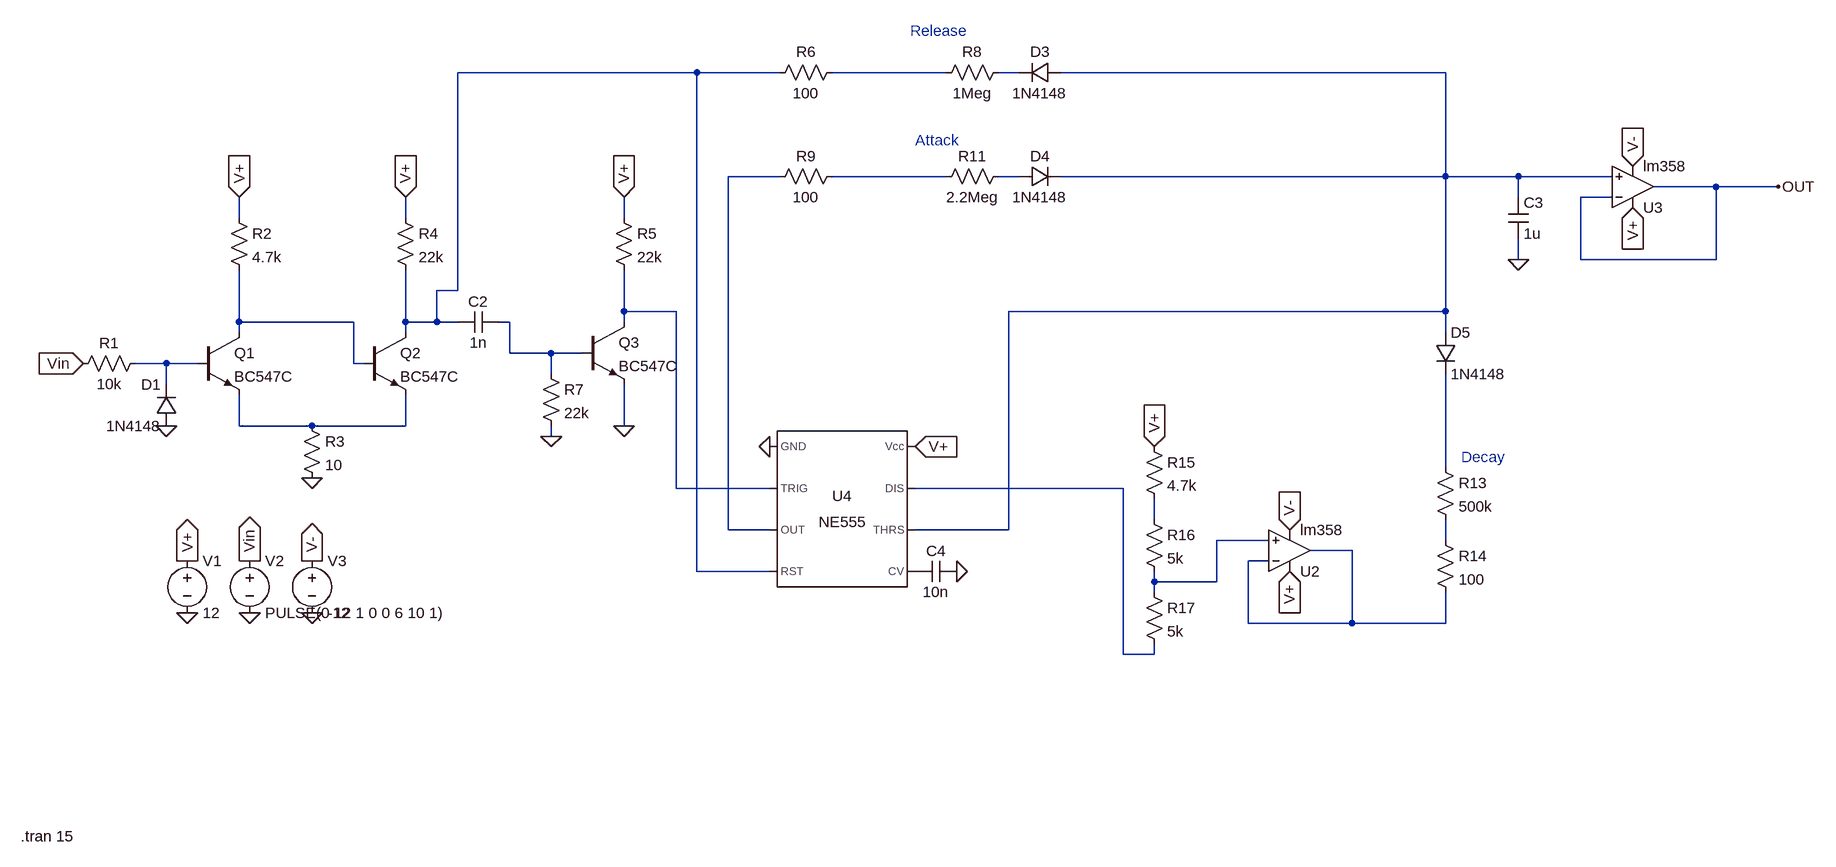
[diagram p0: schematic Copia de EG con NE555 aprendiendo.asc]
Copia de EG con NE555 aprendiendo.asc, the LTspice schematic file:
Version 4
SHEET 1 1860 680
WIRE 128 -560 -240 -560
WIRE 256 -560 128 -560
WIRE 512 -560 336 -560
WIRE 624 -560 592 -560
WIRE 1280 -560 688 -560
WIRE 256 -400 176 -400
WIRE 512 -400 336 -400
WIRE 624 -400 592 -400
WIRE 1280 -400 1280 -560
WIRE 1280 -400 688 -400
WIRE 1392 -400 1280 -400
WIRE 1536 -400 1392 -400
WIRE 1696 -384 1600 -384
WIRE 1792 -384 1696 -384
WIRE 1392 -368 1392 -400
WIRE 1536 -368 1488 -368
WIRE -576 -336 -576 -368
WIRE -320 -336 -320 -368
WIRE 16 -336 16 -368
WIRE 1392 -272 1392 -304
WIRE 1488 -272 1488 -368
WIRE 1696 -272 1696 -384
WIRE 1696 -272 1488 -272
WIRE -240 -224 -240 -560
WIRE -240 -224 -272 -224
WIRE 16 -192 16 -256
WIRE 96 -192 16 -192
WIRE 1280 -192 1280 -400
WIRE 1280 -192 608 -192
WIRE -576 -176 -576 -256
WIRE -400 -176 -576 -176
WIRE -320 -176 -320 -256
WIRE -272 -176 -272 -224
WIRE -272 -176 -320 -176
WIRE -240 -176 -272 -176
WIRE -160 -176 -176 -176
WIRE 16 -176 16 -192
WIRE -576 -160 -576 -176
WIRE -320 -160 -320 -176
WIRE 1280 -160 1280 -192
WIRE -160 -128 -160 -176
WIRE -96 -128 -160 -128
WIRE -48 -128 -96 -128
WIRE -688 -112 -736 -112
WIRE -640 -112 -688 -112
WIRE -400 -112 -400 -176
WIRE -384 -112 -400 -112
WIRE -96 -96 -96 -128
WIRE -688 -80 -688 -112
WIRE -576 -16 -576 -64
WIRE -464 -16 -576 -16
WIRE -320 -16 -320 -64
WIRE -320 -16 -464 -16
WIRE 16 -16 16 -80
WIRE -96 0 -96 -16
WIRE 1280 48 1280 -96
WIRE 96 80 96 -192
WIRE 240 80 96 80
WIRE 784 80 464 80
WIRE 832 128 832 96
WIRE 176 144 176 -400
WIRE 240 144 176 144
WIRE 608 144 608 -192
WIRE 608 144 464 144
WIRE 1008 160 928 160
WIRE 1280 160 1280 128
WIRE 1136 176 1072 176
WIRE 1008 192 976 192
WIRE 128 208 128 -560
WIRE 240 208 128 208
WIRE 832 224 832 208
WIRE 928 224 928 160
WIRE 928 224 832 224
WIRE 832 240 832 224
WIRE 976 288 976 192
WIRE 1136 288 1136 176
WIRE 1136 288 976 288
WIRE 1280 288 1280 240
WIRE 1280 288 1136 288
WIRE 784 336 784 80
WIRE 832 336 832 320
WIRE 832 336 784 336
FLAG -464 272 0
FLAG -560 272 0
FLAG -656 272 0
FLAG -656 192 V+
IOPIN -656 192 Out
FLAG -560 192 Vin
IOPIN -560 192 Out
FLAG -816 -112 Vin
IOPIN -816 -112 In
FLAG -688 -16 0
FLAG -576 -368 V+
IOPIN -576 -368 In
FLAG -320 -368 V+
IOPIN -320 -368 In
FLAG -96 0 0
FLAG 16 -368 V+
IOPIN 16 -368 In
FLAG 16 -16 0
FLAG 832 16 V+
IOPIN 832 16 In
FLAG -464 192 V-
IOPIN -464 192 Out
FLAG 1040 208 V+
IOPIN 1040 208 In
FLAG 1040 144 V-
IOPIN 1040 144 In
FLAG 1568 -352 V+
IOPIN 1568 -352 In
FLAG 1568 -416 V-
IOPIN 1568 -416 In
FLAG 1392 -272 0
FLAG 1792 -384 OUT
FLAG 240 16 0
FLAG 528 208 0
FLAG 464 16 V+
IOPIN 464 16 In
FLAG -464 64 0
SYMBOL voltage -656 176 R0
WINDOW 123 0 0 Left 0
WINDOW 39 0 0 Left 0
SYMATTR InstName V1
SYMATTR Value 12
SYMBOL voltage -560 176 R0
WINDOW 123 0 0 Left 0
WINDOW 39 0 0 Left 0
SYMATTR InstName V2
SYMATTR Value PULSE(0 12 1 0 0 6 10 1)
SYMBOL voltage -464 176 R0
WINDOW 123 0 0 Left 0
WINDOW 39 0 0 Left 0
SYMATTR InstName V3
SYMATTR Value -12
SYMBOL res -720 -128 R90
WINDOW 0 0 56 VBottom 2
WINDOW 3 32 56 VTop 2
SYMATTR InstName R1
SYMATTR Value 10k
SYMBOL diode -672 -16 R180
WINDOW 0 24 64 Left 2
WINDOW 3 24 0 Left 2
SYMATTR InstName D1
SYMATTR Value 1N4148
SYMBOL npn -640 -160 R0
SYMATTR InstName Q1
SYMATTR Value BC547C
SYMBOL res -592 -352 R0
SYMATTR InstName R2
SYMATTR Value 4.7k
SYMBOL npn -384 -160 R0
SYMATTR InstName Q2
SYMATTR Value BC547C
SYMBOL res -336 -352 R0
SYMATTR InstName R4
SYMATTR Value 22k
SYMBOL cap -176 -192 R90
WINDOW 0 0 32 VBottom 2
WINDOW 3 32 32 VTop 2
SYMATTR InstName C2
SYMATTR Value 1n
SYMBOL npn -48 -176 R0
SYMATTR InstName Q3
SYMATTR Value BC547C
SYMBOL res 0 -352 R0
SYMATTR InstName R5
SYMATTR Value 22k
SYMBOL res 352 -576 R90
WINDOW 0 0 56 VBottom 2
WINDOW 3 32 56 VTop 2
SYMATTR InstName R6
SYMATTR Value 100
SYMBOL res 608 -576 R90
WINDOW 0 0 56 VBottom 2
WINDOW 3 32 56 VTop 2
SYMATTR InstName R8
SYMATTR Value 1Meg
SYMBOL diode 688 -576 R90
WINDOW 0 0 32 VBottom 2
WINDOW 3 32 32 VTop 2
SYMATTR InstName D3
SYMATTR Value 1N4148
SYMBOL res 352 -416 R90
WINDOW 0 0 56 VBottom 2
WINDOW 3 32 56 VTop 2
SYMATTR InstName R9
SYMATTR Value 100
SYMBOL res 608 -416 R90
WINDOW 0 0 56 VBottom 2
WINDOW 3 32 56 VTop 2
SYMATTR InstName R11
SYMATTR Value 2.2Meg
SYMBOL diode 624 -384 R270
WINDOW 0 32 32 VTop 2
WINDOW 3 0 32 VBottom 2
SYMATTR InstName D4
SYMATTR Value 1N4148
SYMBOL diode 1264 -160 R0
SYMATTR InstName D5
SYMATTR Value 1N4148
SYMBOL res 1264 32 R0
SYMATTR InstName R13
SYMATTR Value 500k
SYMBOL res 1264 144 R0
SYMATTR InstName R14
SYMATTR Value 100
SYMBOL res 816 0 R0
SYMATTR InstName R15
SYMATTR Value 4.7k
SYMBOL res 816 112 R0
SYMATTR InstName R16
SYMATTR Value 5k
SYMBOL res 816 224 R0
SYMATTR InstName R17
SYMATTR Value 5k
SYMBOL lm358 1040 240 M180
SYMATTR InstName U2
SYMBOL lm358 1568 -320 M180
SYMATTR InstName U3
SYMBOL cap 1376 -368 R0
SYMATTR InstName C3
SYMATTR Value 1u
SYMBOL Misc\\NE555 352 112 R0
SYMATTR InstName U4
SYMBOL cap 528 192 R90
WINDOW 0 0 32 VBottom 2
WINDOW 3 32 32 VTop 2
SYMATTR InstName C4
SYMATTR Value 10n
SYMBOL res -112 -112 R0
SYMATTR InstName R7
SYMATTR Value 22k
SYMBOL res -480 -32 R0
SYMATTR InstName R3
SYMATTR Value 10
TEXT 456 -624 Left 2 ;Release
TEXT 464 -456 Left 2 ;Attack
TEXT 1304 32 Left 2 ;Decay
TEXT -912 616 Left 2 !.tran 15

The netlist it stands for:
* Copia de EG con NE555 aprendiendo.asc
V1 V+ 0 12
V2 Vin 0 PULSE(0 12 1 0 0 6 10 1)
V3 V- 0 -12
R1 N011 Vin 10k
D1 0 N011 1N4148
Q1 N009 N011 N012 0 BC547C
R2 V+ N009 4.7k
Q2 N001 N009 N012 0 BC547C
R4 V+ N001 22k
C2 N010 N001 1n
Q3 N008 N010 0 0 BC547C
R5 V+ N008 22k
R6 N002 N001 100
R8 N003 N002 1Meg
D3 N004 N003 1N4148
R9 N006 N005 100
R11 N007 N006 2.2Meg
D4 N007 N004 1N4148
D5 N004 N013 1N4148
R13 N013 N017 500k
R14 N017 N018 100
R15 V+ N015 4.7k
R16 N015 N016 5k
R17 N016 N014 5k
* U2: lm358 (symbol lm358 not available, pins judged from their places): In+=N016 In-=N018 V+=V+ V-=V- OUT=N018
* U3: lm358 (symbol lm358 not available, pins judged from their places): In+=N004 In-=OUT V+=V+ V-=V- OUT=OUT
C3 N004 0 1u
XU4 0 N008 N005 N001 P001 N004 N014 V+ NE555  ; pins GND TRIG OUT RST CV THRS DIS Vcc
C4 0 P001 10n
R7 N010 0 22k
R3 N012 0 10
.model D D
.lib standard.dio
.model NPN NPN
.model PNP PNP
.lib standard.bjt
* Release
* Attack
* Decay
.tran 15
.lib NE555.sub
.backanno
.end